# EAGLE design SmartCar ESP V4 (EAGLE 9.6.2)
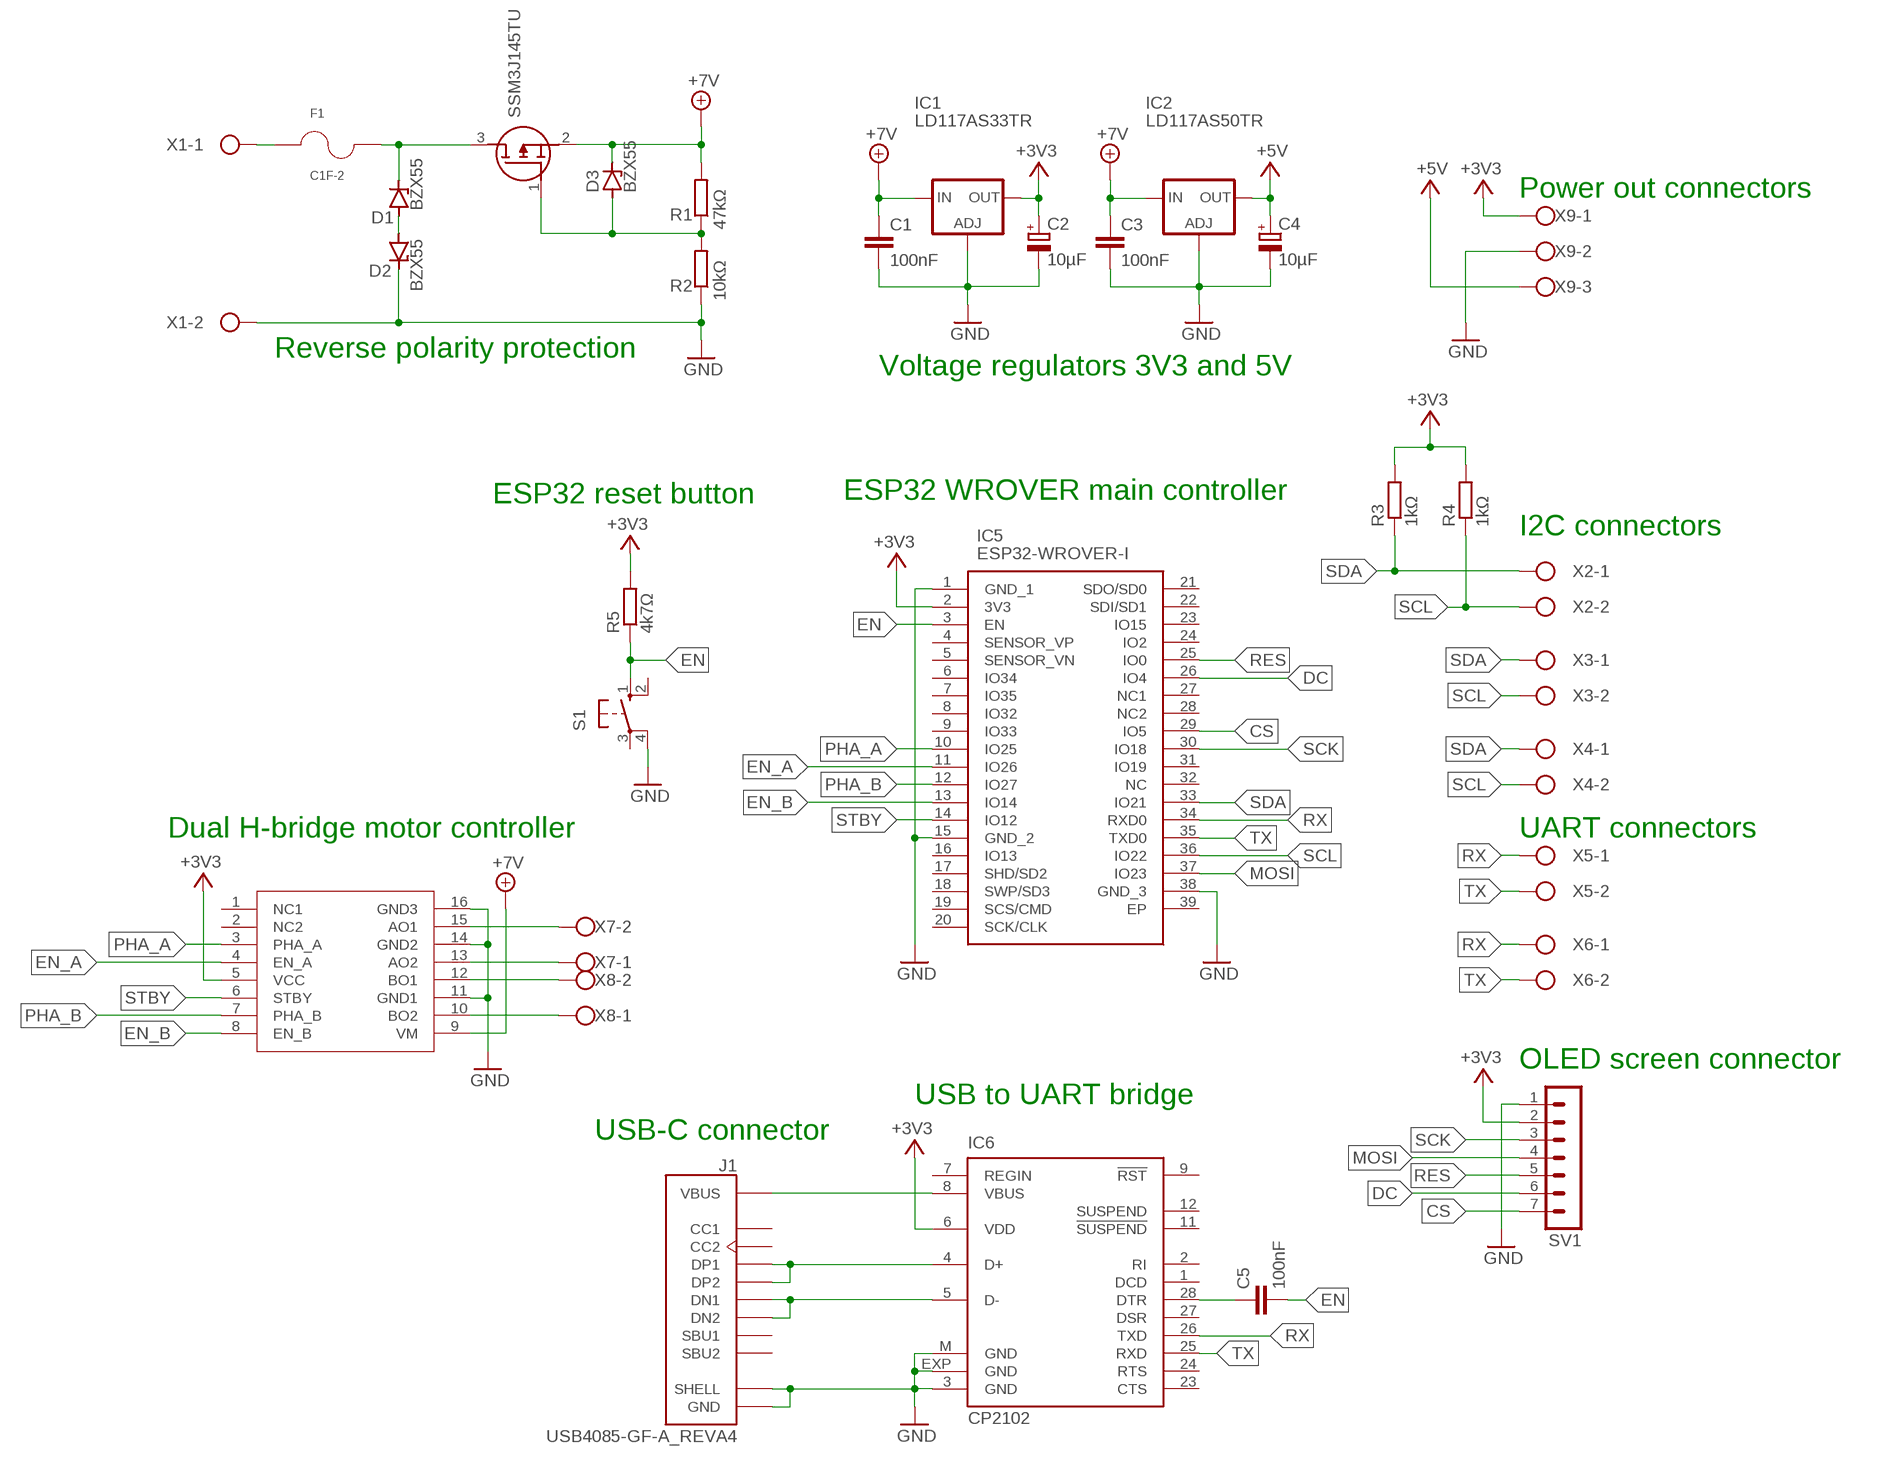
[diagram p0: schematic, sheet 1]

## Parts
C1  100nF  C-EUC0805  [C0805]
C2  10µF  CPOL-EUE2,5-6E  [E2,5-6E]
C3  100nF  C-EUC0805  [C0805]
C4  10µF  CPOL-EUE2,5-6E  [E2,5-6E]
C5  100nF  C-EUC0805  [C0805]
D1  BZX55  [DO35Z10]
D2  BZX55  [DO35Z10]
D3  BZX55  [DO35Z10]
F1  C1F-2  [FUSC3215X83N]
IC1  LD117AS33TR  [SOT223]
IC2  LD117AS50TR  [SOT223]
IC5  ESP32-WROVER-I  [ESP32WROVERI]
IC6  CP2102  [MLP28]
J1  USB4085-GF-A_REVA4  [GCT_USB4085-GF-A_REVA4]
R1  47kΩ  R-EU_R0805  [R0805]
R2  10kΩ  R-EU_R0805  [R0805]
R3  1kΩ  R-EU_R0805  [R0805]
R4  1kΩ  R-EU_R0805  [R0805]
R5  4k7Ω  R-EU_R0805  [R0805]
S1  0  10-XX  [B3F-10XX]
SV1  0  MA07-1  [MA07-1]
U$1  TC78H621FNG  [SOP65P640X110-16N]
U$2  SSM3J145TU  [SOTFL65P210X75-3N]
X1  0  W237-102  [W237-102]
X2  0  W237-102  [W237-102]
X3  0  W237-102  [W237-102]
X4  0  W237-102  [W237-102]
X5  0  W237-102  [W237-102]
X6  0  W237-102  [W237-102]
X7  0  W237-102  [W237-102]
X8  0  W237-102  [W237-102]
X9  0  W237-103  [W237-103]

## Nets
+3V3: C2.+ IC1.4(OUT) IC5.2(3V3) IC6.6(VDD) R3.2 R4.2 R5.2 SV1.2 U$1.5(VCC) X9.1
+5V: C4.+ IC2.4(OUT) X9.3
+7V: C1.1 C3.1 D3.C IC1.3(IN) IC2.3(IN) R1.2 U$1.9(VM) U$2.2(S)
AO1: U$1.15(AO1) X7.2
AO2: U$1.13(AO2) X7.1
BO1: U$1.12(BO1) X8.2
BO2: U$1.10(BO2) X8.1
CS: IC5.29(IO5) SV1.7
D1-D2: D1.A D2.A
D+: IC6.4(D+) J1.A6(DP1) J1.B6(DP2)
D-: IC6.5(D-) J1.A7(DN1) J1.B7(DN2)
DC: IC5.26(IO4) SV1.6
DRAIN: D1.C F1.2 U$2.3(D)
DTR: C5.1 IC6.28(DTR)
EN: C5.2 IC5.3(EN) R5.1 S1.1(S)
EN_A: IC5.11(IO26) U$1.4(EN_A)
EN_B: IC5.13(IO14) U$1.8(EN_B)
GATE: D3.A R1.1 R2.2 U$2.1(G)
GND: C1.2 C2.- C3.2 C4.- D2.C IC1.1(ADJ) IC2.1(ADJ) IC5.1(GND_1) IC5.15(GND_2) IC5.38(GND_3) IC6.3(GND) IC6.EXP(GND) IC6.M(GND) J1.A1(GND) J1.A12(GND) J1.B1(GND) J1.B12(GND) J1.P1(SHELL) J1.P2(SHELL) J1.P3(SHELL) J1.P4(SHELL) R2.1 S1.4(P1) SV1.1 U$1.11(GND1) U$1.14(GND2) U$1.16(GND3) X1.2 X9.2
IN: F1.1 X1.1
MOSI: IC5.37(IO23) SV1.4
PHA_A: IC5.10(IO25) U$1.3(PHA_A)
PHA_B: IC5.12(IO27) U$1.7(PHA_B)
RES: IC5.25(IO0) SV1.5
RX: IC5.34(RXD0) IC6.26(TXD) X5.1 X6.1
SCK: IC5.30(IO18) SV1.3
SCL: IC5.36(IO22) R4.1 X2.2 X3.2 X4.2
SDA: IC5.33(IO21) R3.1 X2.1 X3.1 X4.1
STBY: IC5.14(IO12) U$1.6(STBY)
TX: IC5.35(TXD0) IC6.25(RXD) X5.2 X6.2
VBUS: IC6.8(VBUS) J1.A4(VBUS) J1.A9(VBUS) J1.B4(VBUS) J1.B9(VBUS)
Unconnected: IC5.4(SENSOR_VP) IC5.5(SENSOR_VN) IC5.6(IO34) IC5.7(IO35) IC5.8(IO32) IC5.9(IO33) IC5.16(IO13) IC5.17(SHD/SD2) IC5.18(SWP/SD3) IC5.19(SCS/CMD) IC5.20(SCK/CLK) IC5.21(SDO/SD0) IC5.22(SDI/SD1) IC5.23(IO15) IC5.24(IO2) IC5.27(NC1) IC5.28(NC2) IC5.31(IO19) IC5.32(NC) IC5.39(EP) IC6.1(DCD) IC6.2(RI) IC6.7(REGIN) IC6.9(!RST) IC6.11(!SUSPEND) IC6.12(SUSPEND) IC6.23(CTS) IC6.24(RTS) IC6.27(DSR) J1.A5(CC1) J1.A8(SBU1) J1.B5(CC2) J1.B8(SBU2) S1.2(S1) S1.3(P) U$1.1(NC1) U$1.2(NC2)

## Notes on the sheet
- Power out connectors
- Reverse polarity protection
- Voltage regulators 3V3 and 5V
- ESP32 reset button
- ESP32 WROVER main controller
- I2C connectors
- Dual H-bridge motor controller | UART connectors
- OLED screen connector
- USB to UART bridge
- USB-C connector

## Library data of the parts
C1 C3 C5 = rcl:C-EU: CAPACITOR, European symbol; SPICEPREFIX: C
C2 C4 = rcl:CPOL-EU: POLARIZED CAPACITOR, European symbol; SPICEPREFIX: C
D1-D3 = diode:BZX55: Z DIODE
F1 = C1F-2:C1F-2: C1F 1 (0685F1000-01) | 1206 SMT Fuse | Fast Acting | 1A; A_MAX: 0.83; A_MIN: 0.83; A_NOM: 0.83; D_MAX: 3.4; D_MIN: 3.0; D_NOM: 3.2; E_MAX: 1.78; E_MIN: 1.38; E_NOM: 1.58; L1_MAX: 0.76; L1_MIN: 0.26; L1_NOM: 0.51; L_MAX: 0.76; L_MIN: 0.26; L_NOM: 0.51; MANUFACTURER: Bel Fuse Inc.; PARTREV: Jan2019; STANDARD: IPC 7351B
IC1 IC2 = v-reg:LD117A?*: Low drop fixed and adjustable positive voltage regulators 1 A Source: http://www.st.com/stonline/products/literature/ds/7194/ld1117axx.pdf
IC5 = ESP32-WROVER-I:ESP32-WROVER-I: WiFi Modules (802.11) SMD Module, ESP32-D0WDQ6, 64Mbits PSRAM, 32Mbits SPI flash, IPEX Antenna connector Source: Datasheet <https://www.mouser.es/datasheet/2/891/esp32-wrover_datasheet_en-1223875.pdf>; DESCRIPTION: WiFi Modules (802.11) SMD Module, ESP32-D0WDQ6, 64Mbits PSRAM, 32Mbits SPI flash, IPEX Antenna connector; HEIGHT: 3mm; MANUFACTURER_NAME: Espressif Systems; MANUFACTURER_PART_NUMBER: ESP32-WROVER-I; MOUSER_PART_NUMBER: 356-ESP32-WROVER-I
IC6 = silabs:CP210*: Single-Chip USB to UART Bridge Source: www.silabs.com .. CP2101.pdf / cp2102.pdf; MF: FARNELL; MPN: CP2102-GM; OC_FARNELL: 9282130; OC_NEWARK: 30K5635
J1 = USB4085-GF-A_REVA4:USB4085-GF-A_REVA4: USB 2.0 Type C Receptacle Dip Type, PCB Top Mount Check availability <https://pricing.snapeda.com/parts/USB4085-GF-A/Global%20Connector%20Technology/view-part?ref=eda>; AVAILABILITY: In Stock; DESCRIPTION: USB-C (USB TYPE-C) USB 2.0 Receptacle Connector 24 (16+8 Dummy) Position Through Hole, Right Angle, low cost, 3.46mm profile, 16 pin, horizontal, Top mount; MF: Global Connector Technology; MP: USB4085-GF-A; PACKAGE: None; PRICE: None; PURCHASE-URL: https://pricing.snapeda.com/search/part/USB4085-GF-A/?ref=eda
R1-R5 = rcl:R-EU_: RESISTOR, European symbol; SPICEPREFIX: R
S1 = switch-omron:10-XX: OMRON SWITCH; MPN: B3F-1000; OC_FARNELL: 176432; OC_NEWARK: 36M3542
SV1 = con-lstb:MA07-1: PIN HEADER; OC_FARNELL: unknown; OC_NEWARK: unknown
U$1 = TC78H621FNG:TC78H621FNG
U$2 = SSM3J145TU:SSM3J145TU
X1-X8 = con-wago-500:W237-102: WAGO SCREW CLAMP; MPN: 237-102; OC_FARNELL: unknown; OC_NEWARK: 70K9898
X9 = con-wago-500:W237-103: WAGO SCREW CLAMP; MPN: 237-103; OC_FARNELL: unknown; OC_NEWARK: 18M7116

## Board
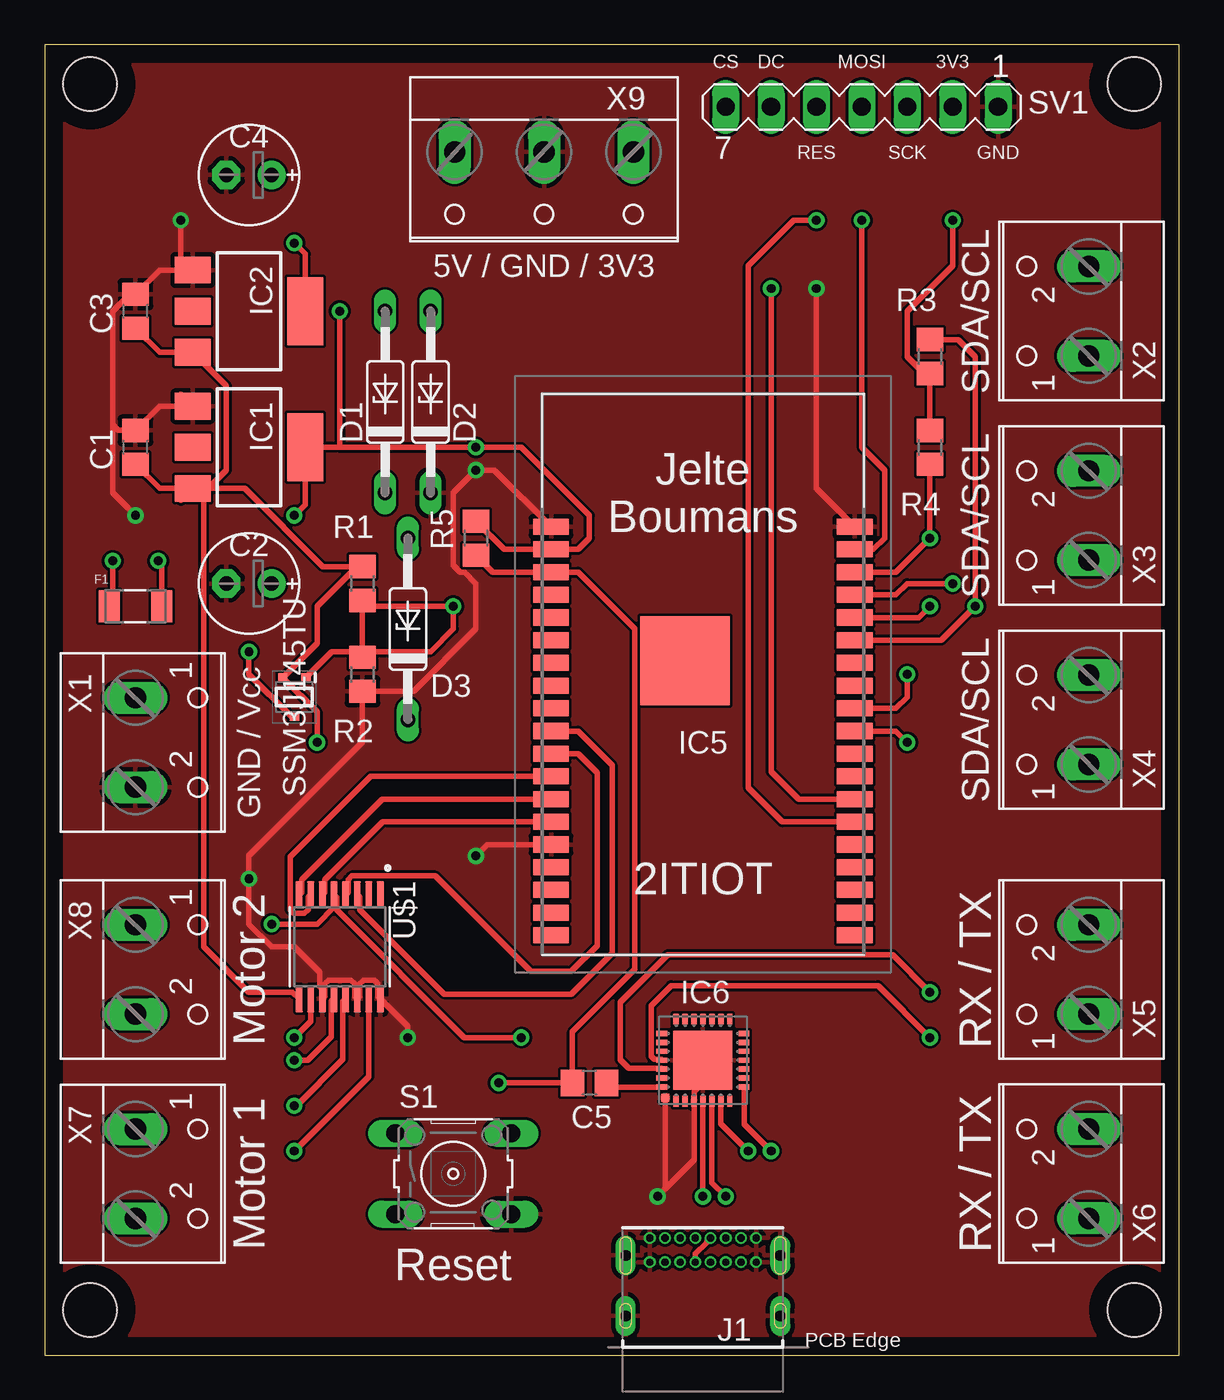
[diagram p1: board, top side]
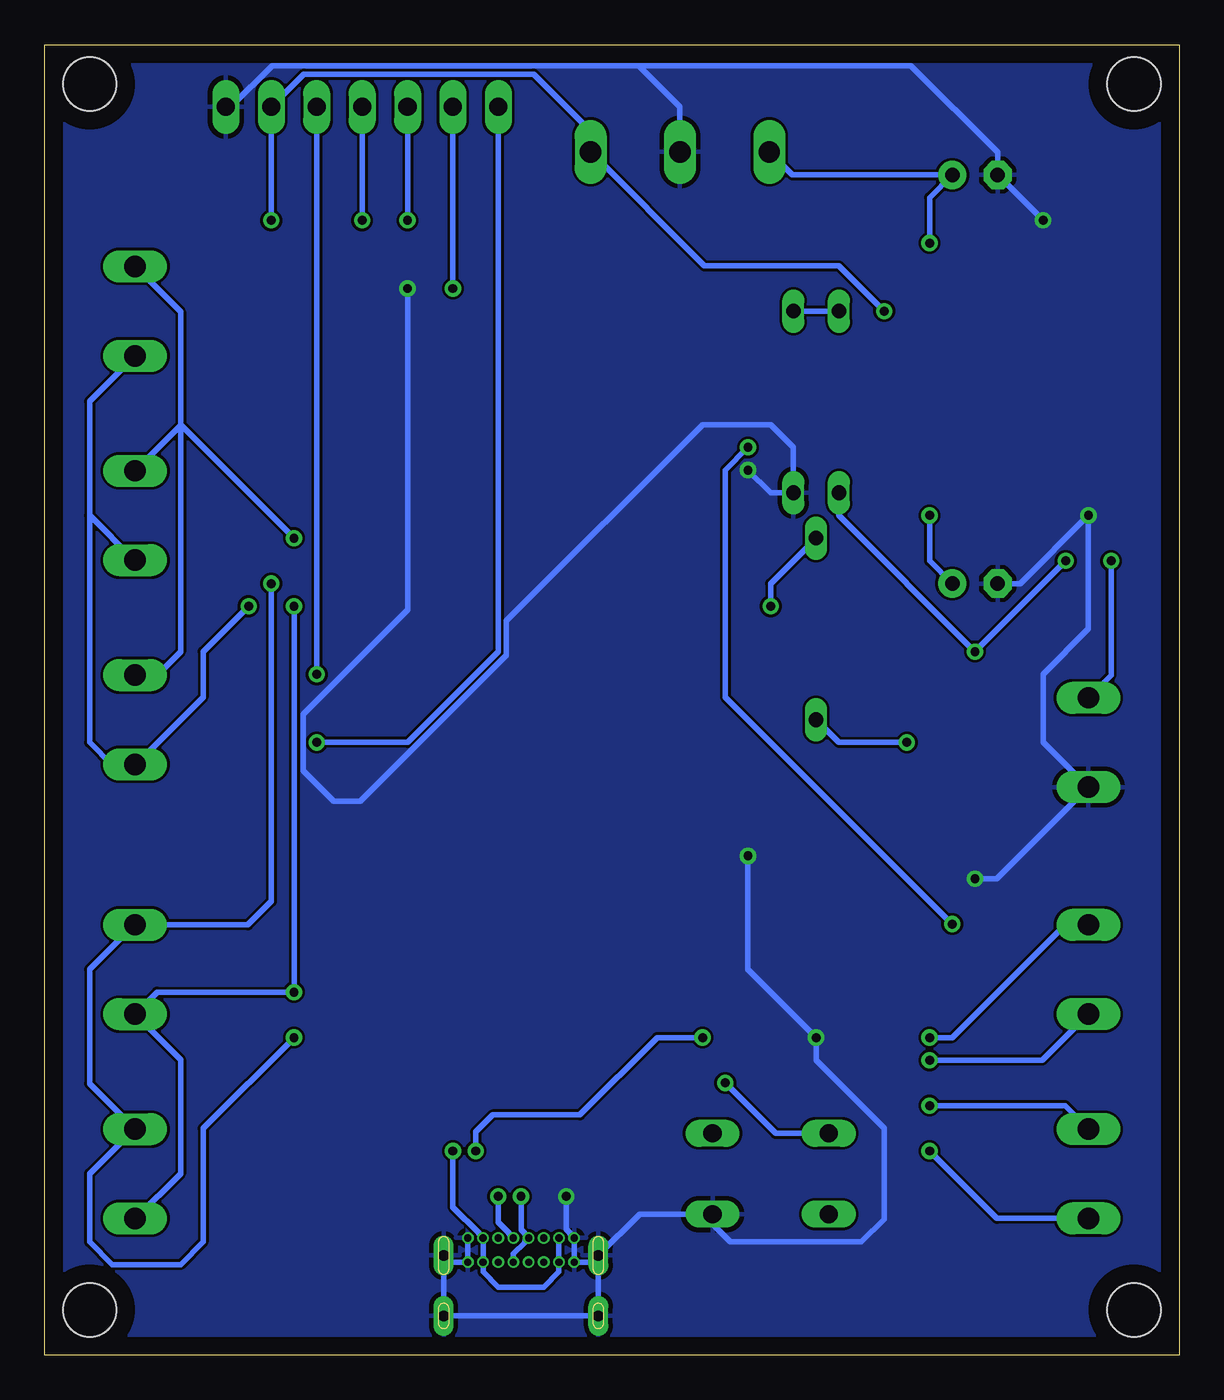
[diagram p2: board, bottom side, seen from below]

Size 63.48 x 73.33 mm. Coordinates in mm from the lower left corner, seen from the top.
Outline: 0,0 63.48,0 63.48,73.33 0,73.33 0,0
Copper layers (1*16): Top 0.035mm / dielectric 0.15mm / Bottom 0.035mm
Design rules "default *": minimum track width 6mil, minimum drill 0.35mm, track to track 6mil, track to pad 6mil, pad to pad 6mil, via to via 6mil, smd to smd 6mil, copper to edge 40mil, drill to drill 6mil, minimum pad ring 0mil, minimum via ring 8mil, stop-mask expansion 4mil, vias tented up to drill 0mil, thermal gap 10mil
Holes 3 mm at 60.96,2.54 60.96,71.12 2.54,71.12 2.54,2.54

### Footprints (pad centres in the part's own frame; a part is rotated, then mirrored left to right if it is on the bottom)
C0805 = smd 1.3 x 1.5: 1 -0.95,0; 2 0.95,0
E2,5-6E = drill 0.813 pad 1.575: + -1.27,0 | drill 0.813 pad 1.575 octagon: - 1.27,0
DO35Z10 = drill 0.813 long: A 5.08,0; C -5.08,0
FUSC3215X83N = smd 1.17 x 1.8: 1 -1.47,0; 2 1.47,0
SOT223 = smd 1.5 x 2: 1 -2.3,-3.15; 2 0,-3.15; 3 2.3,-3.15 | smd 3.8 x 2: 4 0,3.15
ESP32WROVERI = smd 2 x 0.9: 1 -8.5,8.26; 2 -8.5,6.99; 3 -8.5,5.72; 4 -8.5,4.45; 5 -8.5,3.18; 6 -8.5,1.91; 7 -8.5,0.64; 8 -8.5,-0.63; 9 -8.5,-1.9; 10 -8.5,-3.17; 11 -8.5,-4.44; 12 -8.5,-5.71; 13 -8.5,-6.98; 14 -8.5,-8.25; 15 -8.5,-9.52; 16 -8.5,-10.79; 17 -8.5,-12.06; 18 -8.5,-13.33; 19 -8.5,-14.6; 20 8.5,-14.6; 21 8.5,-13.33; 22 8.5,-12.06; 23 8.5,-10.79; 24 8.5,-9.52; 25 8.5,-8.25; 26 8.5,-6.98; 27 8.5,-5.71; 28 8.5,-4.44; 29 8.5,-3.17; 30 8.5,-1.9; 31 8.5,-0.63; 32 8.5,0.64; 33 8.5,1.91; 34 8.5,3.18; 35 8.5,4.45; 36 8.5,5.72; 37 8.5,6.99; 38 8.5,8.26 | smd 5 x 5: 39 -1,0.76
MLP28 = smd 0.6 x 0.3: 1 -2.3,1.5; 2 -2.3,1; 3 -2.3,0.5; 4 -2.3,0; 5 -2.3,-0.5; 6 -2.3,-1; 7 -2.3,-1.5; 15 2.3,-1.5; 16 2.3,-1; 17 2.3,-0.5; 18 2.3,0; 19 2.3,0.5; 20 2.3,1; 21 2.3,1.5 | smd 0.3 x 0.6: 8 -1.5,-2.3; 9 -1,-2.3; 10 -0.5,-2.3; 11 0,-2.3; 12 0.5,-2.3; 13 1,-2.3; 14 1.5,-2.3; 22 1.5,2.3; 23 1,2.3; 24 0.5,2.3; 25 0,2.3; 26 -0.5,2.3; 27 -1,2.3; 28 -1.5,2.3 | smd 3.3 x 3.3: EXP 0,0 | smd 0.435 x 0.435: M -2.103,2.103
GCT_USB4085-GF-A_REVA4 = drill 0.4 pad 0.65: A1 -2.975,4.025; A4 -2.125,4.025; A5 -1.275,4.025; A6 -0.425,4.025; A7 0.425,4.025; A8 1.275,4.025; A9 2.125,4.025; A12 2.975,4.025; B1 2.975,2.675; B4 2.125,2.675; B5 1.275,2.675; B6 0.425,2.675; B7 -0.425,2.675; B8 -1.275,2.675; B9 -2.125,2.675; B12 -2.975,2.675 | drill 0.6 pad 1.108 long: P1 -4.325,3.045; P2 4.325,3.045; P3 4.325,-0.335; P4 -4.325,-0.335
R0805 = smd 1.3 x 1.5: 1 -0.95,0; 2 0.95,0
B3F-10XX = drill 1.016 long: 1 -3.251,2.261; 2 3.251,2.261; 3 -3.251,-2.261; 4 3.251,-2.261
MA07-1 = drill 1.016 long: 1 -7.62,0; 2 -5.08,0; 3 -2.54,0; 4 0,0; 5 2.54,0; 6 5.08,0; 7 7.62,0
SOP65P640X110-16N = smd 1.49 x 0.4: 1 -2.915,2.275; 2 -2.915,1.625; 3 -2.915,0.975; 4 -2.915,0.325; 5 -2.915,-0.325; 6 -2.915,-0.975; 7 -2.915,-1.625; 8 -2.915,-2.275; 9 2.915,-2.275; 10 2.915,-1.625; 11 2.915,-0.975; 12 2.915,-0.325; 13 2.915,0.325; 14 2.915,0.975; 15 2.915,1.625; 16 2.915,2.275
SOTFL65P210X75-3N = smd 0.475 x 0.52: 1 -1.088,0.65; 2 -1.088,-0.65; 3 1.088,0
W237-102 = drill 1.194 long: 1 -2.5,-1.27; 2 2.5,-1.27
W237-103 = drill 1.194 long: 1 -5,-1.29; 2 0,-1.29; 3 5,-1.29

### Placement (x,y rotation side)
C1  5.08,50.8 90 top
C2  11.43,43.18 180 top
C3  5.08,58.42 90 top
C4  11.43,66.04 180 top
C5  30.48,15.24 180 top
D1  19.05,53.34 90 top
D2  21.59,53.34 90 top
D3  20.32,40.64 90 top
F1  5.08,41.91 0 top
IC1  11.43,50.8 270 top
IC2  11.43,58.42 270 top
IC5  36.83,38.1 0 top
IC6  36.83,16.51 90 top
J1  36.83,2.54 0 top
R1  17.78,43.18 90 top
R2  17.78,38.1 90 top
R3  49.53,55.88 270 top
R4  49.53,50.8 90 top
R5  24.13,45.72 90 top
S1  22.86,10.16 0 top
SV1  45.72,69.85 180 top
U$1  16.51,22.86 270 top
U$2  13.97,36.83 270 top
X1  6.35,34.29 270 top
X2  57.15,58.42 90 top
X3  57.15,46.99 90 top
X4  57.15,35.56 90 top
X5  57.15,21.59 90 top
X6  57.15,10.16 90 top
X7  6.35,10.16 270 top
X8  6.35,21.59 270 top
X9  27.94,66.04 180 top

### Tracks (layer width: path | path; a pad name or v marks a point on that pad's centre or on a via)
+3V3  (via drill 0.5)
  Top 0.305: v13.97,46.99 14.58,47.6 IC1.4 16.51,50.8 | R4.2 R3.2 49.21,54.93 48.26,55.88 48.26,58.42 50.8,60.96 v50.8,63.5 | R5.2 25.71,45.09 IC5.2 29.85,45.09 30.48,45.72 30.48,46.99 26.67,50.8 v24.13,50.8 16.51,50.8 | v26.67,17.78 23.48,17.78 16.33,24.93 16.33,25.63 U$1.5 16.18,25.07 15.24,24.13 v12.7,24.13 | v16.51,58.42 16.51,50.8 | IC6.6 37.83,12.97 v39.37,11.43
  Bottom 0.305: C2.+ 13.97,44.45 v13.97,46.99 | v26.67,17.78 29.21,17.78 33.53,13.46 38.41,13.46 39.37,12.5 v39.37,11.43 | v12.7,24.13 25.4,36.83 25.4,49.53 v24.13,50.8 | v16.51,58.42 19.05,60.96 26.57,60.96 X9.1 32.94,68.5 36.12,71.68 48.97,71.68 SV1.2 v50.8,63.5
+5V  (via drill 0.5)
  Top 0.305: IC2.4 14.58,61.62 v13.97,62.23
  Bottom 0.305: v13.97,62.23 13.97,64.77 C4.+ 21.65,66.04 X9.3
+7V  (via drill 0.5)
  Top 0.305: C3.1 6.43,56.12 IC2.3 10.16,54.24 10.16,49.53 8.89,48.26 | IC1.3 6.43,48.5 C1.1 | 8.89,48.26 8.52,48.26 IC1.3 | IC1.3 7.62,47.84 | U$1.9 13.86,20.32 11.43,20.32 8.89,22.86 8.89,48.26 | v15.24,34.29 15.24,36 U$2.2 15.24,39.84 15.24,41.91 17.46,44.13 R1.2 15.56,44.13 11.19,48.5 IC1.3
  Bottom 0.305: D3.C 19.05,34.29 v15.24,34.29
AO1  (via drill 0.5)
  Top 0.305: U$1.15 18.14,15.6 v13.97,11.43
  Bottom 0.305: X7.2 10.2,7.66 v13.97,11.43
AO2  (via drill 0.5)
  Top 0.305: U$1.13 16.69,19.8 16.69,16.57 14.09,13.97 v13.97,13.97
  Bottom 0.305: X7.1 6.39,13.97 v13.97,13.97
BO1  (via drill 0.5)
  Top 0.305: U$1.12 16.04,19.8 16.04,17.83 14.72,16.51 v13.97,16.51
  Bottom 0.305: X8.2 7.66,16.51 v13.97,16.51
BO2  (via drill 0.5)
  Top 0.305: v13.97,17.78 14.88,18.7 U$1.10
  Bottom 0.305: X8.1 6.39,24.09 12.7,17.78 v13.97,17.78
CS  (via drill 0.5)
  Top 0.305: IC5.29 47.62,34.93 v48.26,34.29
  Bottom 0.305: v48.26,34.29 43.18,34.29 38.1,39.37 SV1.7
D1-D2
  Bottom 0.305: D1.A D2.A
D+  (via drill 0.5)
  Top 0.305: v36.83,8.89 IC6.4
  Bottom 0.305: J1.B6 37.26,5.67 36.62,6.3 36.62,6.34 J1.A6 36.62,6.79 36.62,6.83 36.83,7.03 v36.83,8.89
D-  (via drill 0.5)
  Top 0.305: J1.A7 37.03,6.34 37.03,6.3 36.41,5.67 J1.B7 | IC6.5 37.33,9.66 v38.1,8.89
  Bottom 0.305: J1.A7 37.48,6.79 37.48,6.83 38.1,7.45 v38.1,8.89
DC  (via drill 0.5)
  Top 0.305: v40.64,59.69 40.64,32.66 42.18,31.12 IC5.26
  Bottom 0.305: SV1.6 v40.64,59.69
DRAIN  (via drill 0.5)
  Top 0.305: U$2.3 13.79,35.74 11.43,38.1 v11.43,39.37 | v6.35,44.45 6.55,44.25 F1.2
  Bottom 0.305: v6.35,44.45 v11.43,39.37 19.05,46.99 D1.C
DTR
  Top 0.305: IC6.28 31.66,15.01 C5.1
EN  (via drill 0.5)
  Top 0.305: v25.4,15.24 C5.2 29.53,18.1 33.02,21.59 33.02,40.64 29.84,43.82 IC5.3 25.08,43.82 R5.1
  Bottom 0.305: v25.4,15.24 22.58,12.42 S1.1
EN_A
  Top 0.305: U$1.4 16.98,25.92 16.98,26.62 17.19,26.82 21.85,26.82 27.2,21.48 29.46,21.48 30.91,22.92 30.91,32.59 29.84,33.66 IC5.11
EN_B
  Top 0.305: U$1.8 14.38,25.92 14.38,26.62 18.88,31.12 IC5.13
GATE  (via drill 0.5)
  Top 0.305: 17.78,39.37 R1.1 18.1,41.91 v22.86,41.91 22.86,40.64 21.59,39.37 18.1,39.37 R2.2 17.78,39.37 | U$2.1 16.07,39.37 17.78,39.37
  Bottom 0.305: D3.A 22.86,43.18 v22.86,41.91
GND  (via drill 0.5)
  Top 0.305: IC6.EXP 36.83,15.24 36.33,14.74 IC6.3 36.33,10.93 v34.29,8.89 34.73,9.33 IC6.M | 7.62,53.76 IC1.1 6.43,53.1 C1.2 4.13,51.75 3.81,52.07 | v7.62,63.5 7.62,61.38 IC2.1 6.43,60.72 C3.2 4.76,59.37 3.81,58.42 3.81,52.07 | 3.81,52.07 3.81,48.26 v5.08,46.99 | v20.32,17.78 20.32,18.41 U$1.16 18.64,20.09 18.64,20.79 18.43,21 17.84,21 17.63,20.79 17.63,20.09 U$1.14 17.34,20.09 17.34,20.79 17.13,21 15.89,21 15.68,20.79 15.68,20.32 | 15.68,20.32 15.68,20.09 U$1.11 | IC5.15 24.77,28.58 v24.13,27.94 | 15.68,20.32 15.39,20.61 15.39,21.44 13.97,22.86 12.7,22.86 11.43,24.13 v11.43,26.67 11.43,27.94 17.78,34.29 R2.1 20.64,37.15 24.13,40.64 24.13,43.18 23.5,43.81 23.25,43.81 22.86,44.21 22.86,48.26 v24.13,49.53 25.16,49.53 IC5.1 | IC5.38 43.18,48.51 v43.18,59.69
  Bottom 0.305: J1.P1 J1.P4 J1.P3 J1.P2 40.78,5.21 J1.B1 J1.A12 | J1.P1 32.88,5.21 J1.B12 J1.A1 34.08,6.79 34.08,6.83 34.29,7.04 v34.29,8.89 | v7.62,63.5 C4.- 10.16,67.31 15.01,72.16 30.25,72.16 | C2.- 8.89,43.18 v5.08,46.99 5.08,40.64 7.62,38.1 7.62,34.29 5.1,31.77 | 5.1,31.77 5.12,31.75 10.2,26.67 v11.43,26.67 | v24.13,27.94 24.13,21.59 v20.32,17.78 20.32,16.51 16.51,12.7 16.51,7.62 17.78,6.35 25.12,6.35 26.67,7.9 S1.4 30.19,7.9 J1.P1 | X1.2 5.1,31.77 | v24.13,49.53 22.86,48.26 D2.C 21.59,50.8 22.86,52.07 26.67,52.07 37.64,41.1 37.64,39.18 45.83,30.99 47.3,30.99 49.02,32.71 49.02,35.87 43.18,41.71 v43.18,59.69 | SV1.1 53.07,69.85 50.76,72.16 30.25,72.16 | 30.25,72.16 27.94,69.85 X9.2
  pour Top: 0,73.66 63.5,73.66 63.5,0 0,0
  pour Bottom: 0,73.66 63.5,73.66 63.5,0 0,0
IN  (via drill 0.5)
  Top 0.305: v3.81,44.45 3.81,42.11 F1.1
  Bottom 0.305: X1.1 3.81,38.06 v3.81,44.45
MOSI  (via drill 0.5)
  Top 0.305: v45.72,63.5 45.72,50.8 46.99,49.53 46.99,45.72 46.36,45.09 IC5.37
  Bottom 0.305: SV1.4 v45.72,63.5
PHA_A
  Top 0.305: IC5.10 29.84,34.93 31.75,33.02 31.75,22.5 29.46,20.2 22.36,20.2 17.63,24.93 17.63,25.63 U$1.3
PHA_B
  Top 0.305: IC5.12 18.23,32.39 13.73,27.89 13.73,24.93 13.94,24.73 14.53,24.73 14.74,24.93 14.74,25.63 U$1.7
RES  (via drill 0.5)
  Top 0.305: IC5.25 41.27,29.85 39.37,31.75 39.37,60.96 41.91,63.5 v43.18,63.5
  Bottom 0.305: SV1.5 v43.18,63.5
RX  (via drill 0.5)
  Top 0.305: IC5.34 48.9,41.28 v49.53,41.91 | IC6.26 34.49,16.05 32.69,16.05 32.2,16.54 32.2,19.75 34.86,22.41 47.44,22.41 v49.53,20.32
  Bottom 0.305: X6.1 58.38,7.66 55.88,10.16 55.88,16.55 X5.1 57.19,20.32 v49.53,20.32 | v49.53,20.32 49.55,20.34 | v49.53,41.91 v49.53,20.32
SCK  (via drill 0.5)
  Top 0.305: IC5.30 47.63,36.2 48.26,36.83 v48.26,38.1
  Bottom 0.305: SV1.3 v48.26,38.1
SCL  (via drill 0.5)
  Top 0.305: IC5.36 47.63,43.82 v49.53,45.72 R4.1
  Bottom 0.305: X2.2 55.88,58.38 55.88,52.03 | X4.2 57.19,38.06 55.88,39.37 55.88,52.03 | X3.2 55.88,52.03 | v49.53,45.72 55.84,52.03 55.88,52.03
SDA  (via drill 0.5)
  Top 0.305: IC5.33 50.17,40.01 v52.07,41.91 52.07,55.88 51.12,56.83 R3.1
  Bottom 0.305: X2.1 60.96,53.38 60.96,46.99 | 60.96,46.99 58.46,44.49 X3.1 | 60.96,46.99 60.96,34.29 59.69,33.02 58.42,33.02 | 58.42,33.02 X4.1 | v52.07,41.91 54.61,39.37 54.61,36.83 58.42,33.02
STBY
  Top 0.305: U$1.6 15.68,25.92 15.68,26.62 18.91,29.85 IC5.14
TX  (via drill 0.5)
  Top 0.305: IC5.35 47.63,42.55 48.26,43.18 v50.8,43.18 | v49.53,17.78 46.62,20.68 35.05,20.68 33.92,19.56 33.92,16.73 34.1,16.55 34.48,16.55 IC6.25
  Bottom 0.305: 58.44,12.68 60.96,15.2 60.96,21.59 58.46,24.09 X5.2 52.11,24.09 50.8,25.4 v50.8,43.18 | 58.44,12.68 X6.2 | 58.44,12.68 60.96,10.16 60.96,6.35 59.69,5.08 55.88,5.08 54.61,6.35 54.61,12.7 v49.53,17.78
VBUS  (via drill 0.5)
  Top 0.305: IC6.8 39.13,12.94 v40.64,11.43
  Bottom 0.305: J1.A4 J1.B9 34.7,4.67 35.56,3.81 38.1,3.81 38.95,4.67 J1.B4 J1.A9 39.17,6.79 39.17,6.83 40.64,8.29 v40.64,11.43

### Text on the board
tNames: CS | DC | MOSI | 3V3 | RES | SCK | GND | 5V / GND / 3V3 | SDA/SCL | Jelte / Boumans | SDA/SCL | SDA/SCL | GND / Vcc | 2ITIOT | Motor 2 | RX / TX | Motor 1 | RX / TX | Reset